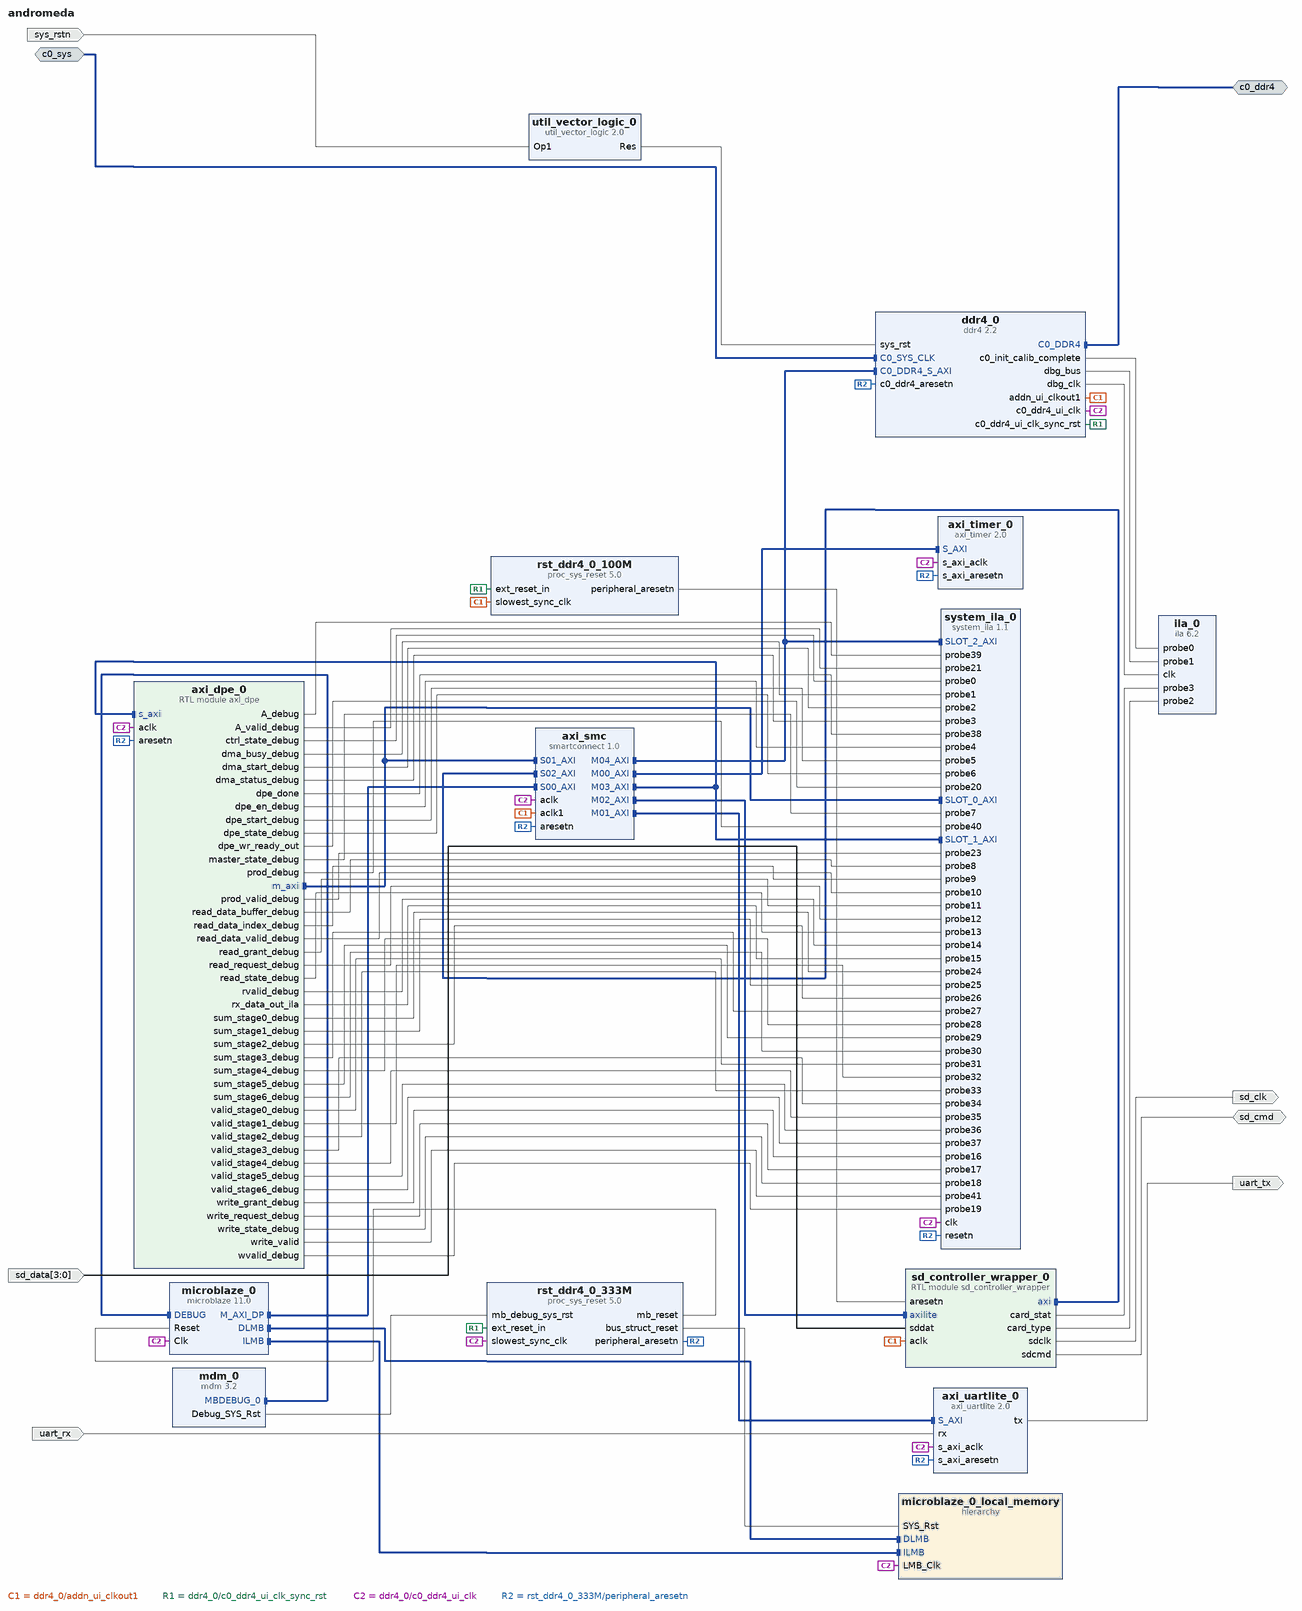
[diagram p0: block diagram of the top level]
# Vivado block design andromeda, xcku5p-ffvb676-2-i, Vivado 2024.2
create_bd_design andromeda

create_bd_intf_port -mode Master -vlnv xilinx.com:interface:ddr4_rtl:1.0 c0_ddr4
create_bd_intf_port -mode Slave -vlnv xilinx.com:interface:diff_clock_rtl:1.0 c0_sys
set_property -dict {CONFIG.FREQ_HZ 200000000} [get_bd_intf_ports c0_sys]
create_bd_port -dir I -type rst sys_rstn
set_property -dict {CONFIG.POLARITY ACTIVE_LOW} [get_bd_ports sys_rstn]
create_bd_port -dir O sd_clk
create_bd_port -dir IO sd_cmd
create_bd_port -dir I -from 3 -to 0 sd_data
create_bd_port -dir I uart_rx
create_bd_port -dir O uart_tx

create_bd_cell -type ip -vlnv xilinx.com:ip:ddr4:2.2 ddr4_0
set_property -dict [list \
  CONFIG.ADDN_UI_CLKOUT1_FREQ_HZ 100 \
  CONFIG.C0.DDR4_AxiIDWidth 4 \
  CONFIG.C0.DDR4_CasLatency 19 \
  CONFIG.C0.DDR4_DataWidth 32 \
  CONFIG.C0.DDR4_InputClockPeriod 5000 \
  CONFIG.C0.DDR4_MemoryPart MT40A512M16LY-075 \
  CONFIG.C0.MIGRATION false \
] [get_bd_cells ddr4_0]
create_bd_cell -type ip -vlnv xilinx.com:ip:ila:6.2 ila_0
set_property -dict [list \
  CONFIG.C_MONITOR_TYPE Native \
  CONFIG.C_NUM_OF_PROBES 4 \
  CONFIG.C_PROBE1_WIDTH 512 \
  CONFIG.C_PROBE2_WIDTH 2 \
  CONFIG.C_PROBE3_WIDTH 4 \
] [get_bd_cells ila_0]
create_bd_cell -type ip -vlnv xilinx.com:ip:util_vector_logic:2.0 util_vector_logic_0
set_property -dict {CONFIG.C_OPERATION not CONFIG.C_SIZE 1} [get_bd_cells util_vector_logic_0]
create_bd_cell -type ip -vlnv xilinx.com:ip:microblaze:11.0 microblaze_0
set_property -dict [list \
  CONFIG.C_DEBUG_ENABLED 1 \
  CONFIG.C_D_AXI 1 \
  CONFIG.C_D_LMB 1 \
  CONFIG.C_ENABLE_CONVERSION 0 \
  CONFIG.C_I_LMB 1 \
  CONFIG.C_USE_DCACHE 0 \
  CONFIG.C_USE_ICACHE 0 \
] [get_bd_cells microblaze_0]
create_bd_cell -type ip -vlnv xilinx.com:ip:axi_uartlite:2.0 axi_uartlite_0
create_bd_cell -type module -reference sd_controller_wrapper sd_controller_wrapper_0
create_bd_cell -type ip -vlnv xilinx.com:ip:axi_timer:2.0 axi_timer_0
create_bd_cell -type hier microblaze_0_local_memory
create_bd_cell -type ip -vlnv xilinx.com:ip:proc_sys_reset:5.0 rst_ddr4_0_333M
create_bd_cell -type ip -vlnv xilinx.com:ip:proc_sys_reset:5.0 rst_ddr4_0_100M
create_bd_cell -type ip -vlnv xilinx.com:ip:smartconnect:1.0 axi_smc
set_property -dict {CONFIG.NUM_CLKS 2 CONFIG.NUM_MI 5 CONFIG.NUM_SI 3} [get_bd_cells axi_smc]
create_bd_cell -type module -reference axi_dpe axi_dpe_0
create_bd_cell -type ip -vlnv xilinx.com:ip:mdm:3.2 mdm_0
create_bd_cell -type ip -vlnv xilinx.com:ip:system_ila:1.1 system_ila_0
set_property -dict [list \
  CONFIG.C_MON_TYPE MIX \
  CONFIG.C_NUM_MONITOR_SLOTS 3 \
  CONFIG.C_NUM_OF_PROBES 42 \
  CONFIG.C_PROBE0_TYPE 0 \
  CONFIG.C_PROBE10_TYPE 0 \
  CONFIG.C_PROBE11_TYPE 0 \
  CONFIG.C_PROBE12_TYPE 0 \
  CONFIG.C_PROBE13_TYPE 0 \
  CONFIG.C_PROBE14_TYPE 0 \
  CONFIG.C_PROBE15_TYPE 0 \
  CONFIG.C_PROBE16_TYPE 0 \
  CONFIG.C_PROBE17_TYPE 0 \
  CONFIG.C_PROBE18_TYPE 0 \
  CONFIG.C_PROBE19_TYPE 0 \
  CONFIG.C_PROBE1_TYPE 0 \
  CONFIG.C_PROBE20_TYPE 0 \
  CONFIG.C_PROBE21_TYPE 0 \
  CONFIG.C_PROBE22_TYPE 0 \
  CONFIG.C_PROBE23_TYPE 0 \
  CONFIG.C_PROBE24_TYPE 0 \
  CONFIG.C_PROBE25_TYPE 0 \
  CONFIG.C_PROBE26_TYPE 0 \
  CONFIG.C_PROBE27_TYPE 0 \
  CONFIG.C_PROBE28_TYPE 0 \
  CONFIG.C_PROBE29_TYPE 0 \
  CONFIG.C_PROBE2_TYPE 0 \
  CONFIG.C_PROBE30_TYPE 0 \
  CONFIG.C_PROBE31_TYPE 0 \
  CONFIG.C_PROBE32_TYPE 0 \
  CONFIG.C_PROBE33_TYPE 0 \
  CONFIG.C_PROBE34_TYPE 0 \
  CONFIG.C_PROBE35_TYPE 0 \
  CONFIG.C_PROBE36_TYPE 0 \
  CONFIG.C_PROBE37_TYPE 0 \
  CONFIG.C_PROBE38_TYPE 0 \
  CONFIG.C_PROBE39_TYPE 0 \
  CONFIG.C_PROBE3_TYPE 0 \
  CONFIG.C_PROBE40_TYPE 0 \
  CONFIG.C_PROBE41_TYPE 0 \
  CONFIG.C_PROBE4_TYPE 0 \
  CONFIG.C_PROBE5_TYPE 0 \
  CONFIG.C_PROBE6_TYPE 0 \
  CONFIG.C_PROBE7_TYPE 0 \
  CONFIG.C_PROBE8_TYPE 0 \
  CONFIG.C_PROBE9_TYPE 0 \
  CONFIG.C_SLOT_0_APC_EN 0 \
  CONFIG.C_SLOT_0_AXI_AR_SEL_DATA 1 \
  CONFIG.C_SLOT_0_AXI_AR_SEL_TRIG 1 \
  CONFIG.C_SLOT_0_AXI_AW_SEL_DATA 1 \
  CONFIG.C_SLOT_0_AXI_AW_SEL_TRIG 1 \
  CONFIG.C_SLOT_0_AXI_B_SEL_DATA 1 \
  CONFIG.C_SLOT_0_AXI_B_SEL_TRIG 1 \
  CONFIG.C_SLOT_0_AXI_R_SEL_DATA 1 \
  CONFIG.C_SLOT_0_AXI_R_SEL_TRIG 1 \
  CONFIG.C_SLOT_0_AXI_W_SEL_DATA 1 \
  CONFIG.C_SLOT_0_AXI_W_SEL_TRIG 1 \
  CONFIG.C_SLOT_0_INTF_TYPE xilinx.com:interface:aximm_rtl:1.0 \
  CONFIG.C_SLOT_1_APC_EN 0 \
  CONFIG.C_SLOT_1_AXI_AR_SEL_DATA 1 \
  CONFIG.C_SLOT_1_AXI_AR_SEL_TRIG 1 \
  CONFIG.C_SLOT_1_AXI_AW_SEL_DATA 1 \
  CONFIG.C_SLOT_1_AXI_AW_SEL_TRIG 1 \
  CONFIG.C_SLOT_1_AXI_B_SEL_DATA 1 \
  CONFIG.C_SLOT_1_AXI_B_SEL_TRIG 1 \
  CONFIG.C_SLOT_1_AXI_R_SEL_DATA 1 \
  CONFIG.C_SLOT_1_AXI_R_SEL_TRIG 1 \
  CONFIG.C_SLOT_1_AXI_W_SEL_DATA 1 \
  CONFIG.C_SLOT_1_AXI_W_SEL_TRIG 1 \
  CONFIG.C_SLOT_1_INTF_TYPE xilinx.com:interface:aximm_rtl:1.0 \
  CONFIG.C_SLOT_2_APC_EN 0 \
  CONFIG.C_SLOT_2_AXI_AR_SEL_DATA 1 \
  CONFIG.C_SLOT_2_AXI_AR_SEL_TRIG 1 \
  CONFIG.C_SLOT_2_AXI_AW_SEL_DATA 1 \
  CONFIG.C_SLOT_2_AXI_AW_SEL_TRIG 1 \
  CONFIG.C_SLOT_2_AXI_B_SEL_DATA 1 \
  CONFIG.C_SLOT_2_AXI_B_SEL_TRIG 1 \
  CONFIG.C_SLOT_2_AXI_R_SEL_DATA 1 \
  CONFIG.C_SLOT_2_AXI_R_SEL_TRIG 1 \
  CONFIG.C_SLOT_2_AXI_W_SEL_DATA 1 \
  CONFIG.C_SLOT_2_AXI_W_SEL_TRIG 1 \
  CONFIG.C_SLOT_2_INTF_TYPE xilinx.com:interface:aximm_rtl:1.0 \
] [get_bd_cells system_ila_0]

# ---- hierarchy /microblaze_0_local_memory ----
current_bd_instance /microblaze_0_local_memory
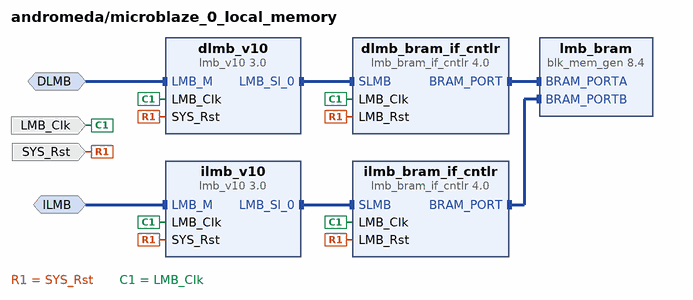
[diagram p1: block diagram inside /microblaze_0_local_memory]
create_bd_intf_pin -mode MirroredMaster -vlnv xilinx.com:interface:lmb_rtl:1.0 DLMB
create_bd_intf_pin -mode MirroredMaster -vlnv xilinx.com:interface:lmb_rtl:1.0 ILMB
create_bd_pin -dir I -type clk LMB_Clk
create_bd_pin -dir I -type rst SYS_Rst

create_bd_cell -type ip -vlnv xilinx.com:ip:lmb_v10:3.0 dlmb_v10
create_bd_cell -type ip -vlnv xilinx.com:ip:lmb_v10:3.0 ilmb_v10
create_bd_cell -type ip -vlnv xilinx.com:ip:lmb_bram_if_cntlr:4.0 dlmb_bram_if_cntlr
set_property -dict {CONFIG.C_ECC 0} [get_bd_cells dlmb_bram_if_cntlr]
create_bd_cell -type ip -vlnv xilinx.com:ip:lmb_bram_if_cntlr:4.0 ilmb_bram_if_cntlr
set_property -dict {CONFIG.C_ECC 0} [get_bd_cells ilmb_bram_if_cntlr]
create_bd_cell -type ip -vlnv xilinx.com:ip:blk_mem_gen:8.4 lmb_bram
set_property -dict {CONFIG.Memory_Type True_Dual_Port_RAM CONFIG.use_bram_block BRAM_Controller} [get_bd_cells lmb_bram]

# ---- connections ----

current_bd_instance /microblaze_0_local_memory
connect_bd_intf_net -intf_net microblaze_0_dlmb [get_bd_intf_pins dlmb_v10/LMB_M] [get_bd_intf_pins DLMB]
connect_bd_intf_net -intf_net microblaze_0_dlmb_bus [get_bd_intf_pins dlmb_v10/LMB_Sl_0] [get_bd_intf_pins dlmb_bram_if_cntlr/SLMB]
connect_bd_intf_net -intf_net microblaze_0_dlmb_cntlr [get_bd_intf_pins dlmb_bram_if_cntlr/BRAM_PORT] [get_bd_intf_pins lmb_bram/BRAM_PORTA]
connect_bd_intf_net -intf_net microblaze_0_ilmb [get_bd_intf_pins ilmb_v10/LMB_M] [get_bd_intf_pins ILMB]
connect_bd_intf_net -intf_net microblaze_0_ilmb_bus [get_bd_intf_pins ilmb_v10/LMB_Sl_0] [get_bd_intf_pins ilmb_bram_if_cntlr/SLMB]
connect_bd_intf_net -intf_net microblaze_0_ilmb_cntlr [get_bd_intf_pins ilmb_bram_if_cntlr/BRAM_PORT] [get_bd_intf_pins lmb_bram/BRAM_PORTB]
connect_bd_net [get_bd_pins SYS_Rst] \
  [get_bd_pins dlmb_v10/SYS_Rst] [get_bd_pins dlmb_bram_if_cntlr/LMB_Rst] [get_bd_pins ilmb_v10/SYS_Rst] \
  [get_bd_pins ilmb_bram_if_cntlr/LMB_Rst]
connect_bd_net -net microblaze_0_Clk [get_bd_pins LMB_Clk] \
  [get_bd_pins dlmb_v10/LMB_Clk] [get_bd_pins dlmb_bram_if_cntlr/LMB_Clk] [get_bd_pins ilmb_v10/LMB_Clk] \
  [get_bd_pins ilmb_bram_if_cntlr/LMB_Clk]
set_property HDL_ATTRIBUTE.BMM_INFO_ADDRESS_SPACE {byte  0x00000000 32 > andromeda microblaze_0_local_memory/lmb_bram} [get_bd_cells dlmb_bram_if_cntlr]
set_property HDL_ATTRIBUTE.KEEP_HIERARCHY yes [get_bd_cells dlmb_bram_if_cntlr]

current_bd_instance /
connect_bd_intf_net -intf_net axi_dpe_0_m_axi [get_bd_intf_pins axi_dpe_0/m_axi] [get_bd_intf_pins axi_smc/S01_AXI]
connect_bd_intf_net [get_bd_intf_pins axi_dpe_0/m_axi] [get_bd_intf_pins system_ila_0/SLOT_0_AXI]
connect_bd_intf_net [get_bd_intf_pins axi_smc/M00_AXI] [get_bd_intf_pins axi_timer_0/S_AXI]
connect_bd_intf_net [get_bd_intf_pins axi_smc/M01_AXI] [get_bd_intf_pins axi_uartlite_0/S_AXI]
connect_bd_intf_net [get_bd_intf_pins axi_smc/M02_AXI] [get_bd_intf_pins sd_controller_wrapper_0/axilite]
connect_bd_intf_net -intf_net axi_smc_M03_AXI [get_bd_intf_pins axi_smc/M03_AXI] [get_bd_intf_pins axi_dpe_0/s_axi]
connect_bd_intf_net [get_bd_intf_pins axi_smc/M03_AXI] [get_bd_intf_pins system_ila_0/SLOT_1_AXI]
connect_bd_intf_net -intf_net axi_smc_M04_AXI [get_bd_intf_pins axi_smc/M04_AXI] [get_bd_intf_pins ddr4_0/C0_DDR4_S_AXI]
connect_bd_intf_net [get_bd_intf_pins axi_smc/M04_AXI] [get_bd_intf_pins system_ila_0/SLOT_2_AXI]
connect_bd_intf_net [get_bd_intf_ports c0_ddr4] [get_bd_intf_pins ddr4_0/C0_DDR4]
connect_bd_intf_net -intf_net diff_clock_rtl_0_1 [get_bd_intf_ports c0_sys] [get_bd_intf_pins ddr4_0/C0_SYS_CLK]
connect_bd_intf_net [get_bd_intf_pins mdm_0/MBDEBUG_0] [get_bd_intf_pins microblaze_0/DEBUG]
connect_bd_intf_net [get_bd_intf_pins microblaze_0/M_AXI_DP] [get_bd_intf_pins axi_smc/S00_AXI]
connect_bd_intf_net [get_bd_intf_pins microblaze_0/DLMB] [get_bd_intf_pins microblaze_0_local_memory/DLMB]
connect_bd_intf_net [get_bd_intf_pins microblaze_0/ILMB] [get_bd_intf_pins microblaze_0_local_memory/ILMB]
connect_bd_intf_net [get_bd_intf_pins sd_controller_wrapper_0/axi] [get_bd_intf_pins axi_smc/S02_AXI]
connect_bd_net -net A_debug [get_bd_pins axi_dpe_0/A_debug] [get_bd_pins system_ila_0/probe39]
connect_bd_net -net A_valid_debug [get_bd_pins axi_dpe_0/A_valid_debug] [get_bd_pins system_ila_0/probe21]
connect_bd_net [get_bd_ports sd_cmd] [get_bd_pins sd_controller_wrapper_0/sdcmd]
connect_bd_net [get_bd_pins axi_uartlite_0/tx] [get_bd_ports uart_tx]
connect_bd_net -net ctrl_state_debug [get_bd_pins axi_dpe_0/ctrl_state_debug] [get_bd_pins system_ila_0/probe0]
connect_bd_net [get_bd_pins ddr4_0/addn_ui_clkout1] \
  [get_bd_pins sd_controller_wrapper_0/aclk] [get_bd_pins rst_ddr4_0_100M/slowest_sync_clk] [get_bd_pins axi_smc/aclk1]
connect_bd_net [get_bd_pins ddr4_0/c0_ddr4_ui_clk_sync_rst] [get_bd_pins rst_ddr4_0_333M/ext_reset_in] [get_bd_pins rst_ddr4_0_100M/ext_reset_in]
connect_bd_net [get_bd_pins ddr4_0/c0_init_calib_complete] [get_bd_pins ila_0/probe0]
connect_bd_net [get_bd_pins ddr4_0/dbg_bus] [get_bd_pins ila_0/probe1]
connect_bd_net [get_bd_pins ddr4_0/dbg_clk] [get_bd_pins ila_0/clk]
connect_bd_net -net dma_busy_debug [get_bd_pins axi_dpe_0/dma_busy_debug] [get_bd_pins system_ila_0/probe1]
connect_bd_net -net dma_start_debug [get_bd_pins axi_dpe_0/dma_start_debug] [get_bd_pins system_ila_0/probe2]
connect_bd_net -net dma_status_debug [get_bd_pins axi_dpe_0/dma_status_debug] [get_bd_pins system_ila_0/probe3]
connect_bd_net -net dpe_done [get_bd_pins axi_dpe_0/dpe_done] [get_bd_pins system_ila_0/probe38]
connect_bd_net -net dpe_en_debug [get_bd_pins axi_dpe_0/dpe_en_debug] [get_bd_pins system_ila_0/probe4]
connect_bd_net -net dpe_start_debug [get_bd_pins axi_dpe_0/dpe_start_debug] [get_bd_pins system_ila_0/probe5]
connect_bd_net -net dpe_state_debug [get_bd_pins axi_dpe_0/dpe_state_debug] [get_bd_pins system_ila_0/probe6]
connect_bd_net -net dpe_wr_ready_out [get_bd_pins axi_dpe_0/dpe_wr_ready_out] [get_bd_pins system_ila_0/probe20]
connect_bd_net -net master_state_debug [get_bd_pins axi_dpe_0/master_state_debug] [get_bd_pins system_ila_0/probe7]
connect_bd_net [get_bd_pins mdm_0/Debug_SYS_Rst] [get_bd_pins rst_ddr4_0_333M/mb_debug_sys_rst]
connect_bd_net -net microblaze_0_Clk [get_bd_pins ddr4_0/c0_ddr4_ui_clk] \
  [get_bd_pins microblaze_0/Clk] [get_bd_pins microblaze_0_local_memory/LMB_Clk] \
  [get_bd_pins rst_ddr4_0_333M/slowest_sync_clk] [get_bd_pins axi_timer_0/s_axi_aclk] [get_bd_pins axi_uartlite_0/s_axi_aclk] \
  [get_bd_pins axi_smc/aclk] [get_bd_pins system_ila_0/clk] [get_bd_pins axi_dpe_0/aclk]
connect_bd_net -net prod_debug [get_bd_pins axi_dpe_0/prod_debug] [get_bd_pins system_ila_0/probe40]
connect_bd_net -net prod_valid_debug [get_bd_pins axi_dpe_0/prod_valid_debug] [get_bd_pins system_ila_0/probe23]
connect_bd_net -net read_data_buffer_debug [get_bd_pins axi_dpe_0/read_data_buffer_debug] [get_bd_pins system_ila_0/probe8]
connect_bd_net -net read_data_index_debug [get_bd_pins axi_dpe_0/read_data_index_debug] [get_bd_pins system_ila_0/probe9]
connect_bd_net -net read_data_valid_debug [get_bd_pins axi_dpe_0/read_data_valid_debug] [get_bd_pins system_ila_0/probe10]
connect_bd_net -net read_grant_debug [get_bd_pins axi_dpe_0/read_grant_debug] [get_bd_pins system_ila_0/probe11]
connect_bd_net -net read_request_debug [get_bd_pins axi_dpe_0/read_request_debug] [get_bd_pins system_ila_0/probe12]
connect_bd_net -net read_state_debug [get_bd_pins axi_dpe_0/read_state_debug] [get_bd_pins system_ila_0/probe13]
connect_bd_net [get_bd_pins rst_ddr4_0_100M/peripheral_aresetn] [get_bd_pins sd_controller_wrapper_0/aresetn]
connect_bd_net [get_bd_pins rst_ddr4_0_333M/bus_struct_reset] [get_bd_pins microblaze_0_local_memory/SYS_Rst]
connect_bd_net [get_bd_pins rst_ddr4_0_333M/mb_reset] [get_bd_pins microblaze_0/Reset]
connect_bd_net [get_bd_pins rst_ddr4_0_333M/peripheral_aresetn] \
  [get_bd_pins axi_timer_0/s_axi_aresetn] [get_bd_pins axi_uartlite_0/s_axi_aresetn] [get_bd_pins ddr4_0/c0_ddr4_aresetn] \
  [get_bd_pins axi_smc/aresetn] [get_bd_pins system_ila_0/resetn] [get_bd_pins axi_dpe_0/aresetn]
connect_bd_net -net rvalid_debug [get_bd_pins axi_dpe_0/rvalid_debug] [get_bd_pins system_ila_0/probe14]
connect_bd_net -net rx_data_out_ila [get_bd_pins axi_dpe_0/rx_data_out_ila] [get_bd_pins system_ila_0/probe15]
connect_bd_net [get_bd_pins sd_controller_wrapper_0/card_stat] [get_bd_pins ila_0/probe3]
connect_bd_net [get_bd_pins sd_controller_wrapper_0/card_type] [get_bd_pins ila_0/probe2]
connect_bd_net [get_bd_pins sd_controller_wrapper_0/sdclk] [get_bd_ports sd_clk]
connect_bd_net [get_bd_ports sd_data] [get_bd_pins sd_controller_wrapper_0/sddat]
connect_bd_net -net sum_stage0_debug [get_bd_pins axi_dpe_0/sum_stage0_debug] [get_bd_pins system_ila_0/probe24]
connect_bd_net -net sum_stage1_debug [get_bd_pins axi_dpe_0/sum_stage1_debug] [get_bd_pins system_ila_0/probe25]
connect_bd_net -net sum_stage2_debug [get_bd_pins axi_dpe_0/sum_stage2_debug] [get_bd_pins system_ila_0/probe26]
connect_bd_net -net sum_stage3_debug [get_bd_pins axi_dpe_0/sum_stage3_debug] [get_bd_pins system_ila_0/probe27]
connect_bd_net -net sum_stage4_debug [get_bd_pins axi_dpe_0/sum_stage4_debug] [get_bd_pins system_ila_0/probe28]
connect_bd_net -net sum_stage5_debug [get_bd_pins axi_dpe_0/sum_stage5_debug] [get_bd_pins system_ila_0/probe29]
connect_bd_net -net sum_stage6_debug [get_bd_pins axi_dpe_0/sum_stage6_debug] [get_bd_pins system_ila_0/probe30]
connect_bd_net [get_bd_ports sys_rstn] [get_bd_pins util_vector_logic_0/Op1]
connect_bd_net [get_bd_ports uart_rx] [get_bd_pins axi_uartlite_0/rx]
connect_bd_net [get_bd_pins util_vector_logic_0/Res] [get_bd_pins ddr4_0/sys_rst]
connect_bd_net -net valid_stage0_debug [get_bd_pins axi_dpe_0/valid_stage0_debug] [get_bd_pins system_ila_0/probe31]
connect_bd_net -net valid_stage1_debug [get_bd_pins axi_dpe_0/valid_stage1_debug] [get_bd_pins system_ila_0/probe32]
connect_bd_net -net valid_stage2_debug [get_bd_pins axi_dpe_0/valid_stage2_debug] [get_bd_pins system_ila_0/probe33]
connect_bd_net -net valid_stage3_debug [get_bd_pins axi_dpe_0/valid_stage3_debug] [get_bd_pins system_ila_0/probe34]
connect_bd_net -net valid_stage4_debug [get_bd_pins axi_dpe_0/valid_stage4_debug] [get_bd_pins system_ila_0/probe35]
connect_bd_net -net valid_stage5_debug [get_bd_pins axi_dpe_0/valid_stage5_debug] [get_bd_pins system_ila_0/probe36]
connect_bd_net -net valid_stage6_debug [get_bd_pins axi_dpe_0/valid_stage6_debug] [get_bd_pins system_ila_0/probe37]
connect_bd_net -net write_grant_debug [get_bd_pins axi_dpe_0/write_grant_debug] [get_bd_pins system_ila_0/probe16]
connect_bd_net -net write_request_debug [get_bd_pins axi_dpe_0/write_request_debug] [get_bd_pins system_ila_0/probe17]
connect_bd_net -net write_state_debug [get_bd_pins axi_dpe_0/write_state_debug] [get_bd_pins system_ila_0/probe18]
connect_bd_net -net write_valid [get_bd_pins axi_dpe_0/write_valid] [get_bd_pins system_ila_0/probe41]
connect_bd_net -net wvalid_debug [get_bd_pins axi_dpe_0/wvalid_debug] [get_bd_pins system_ila_0/probe19]
set_property PFM.AXI_PORT {C0_DDR4_S_AXI_CTRL {memport "MIG" sptag "" memory "" is_range "false"}} [get_bd_cells ddr4_0]
set_property HDL_ATTRIBUTE.BMM_INFO_PROCESSOR {microblaze-le > andromeda microblaze_0_local_memory/dlmb_bram_if_cntlr} [get_bd_cells microblaze_0]
set_property HDL_ATTRIBUTE.KEEP_HIERARCHY yes [get_bd_cells microblaze_0]
set_property HDL_ATTRIBUTE.DEBUG true [get_bd_intf_nets axi_dpe_0_m_axi]
set_property HDL_ATTRIBUTE.MARK_DEBUG true [get_bd_intf_nets axi_dpe_0_m_axi]
set_property HDL_ATTRIBUTE.DEBUG true [get_bd_intf_nets axi_smc_M03_AXI]
set_property HDL_ATTRIBUTE.MARK_DEBUG true [get_bd_intf_nets axi_smc_M03_AXI]
set_property HDL_ATTRIBUTE.DEBUG true [get_bd_intf_nets axi_smc_M04_AXI]
set_property HDL_ATTRIBUTE.MARK_DEBUG true [get_bd_intf_nets axi_smc_M04_AXI]
set_property HDL_ATTRIBUTE.DEBUG true [get_bd_nets A_debug]
set_property HDL_ATTRIBUTE.MARK_DEBUG true [get_bd_nets A_debug]
set_property HDL_ATTRIBUTE.DEBUG true [get_bd_nets A_valid_debug]
set_property HDL_ATTRIBUTE.MARK_DEBUG true [get_bd_nets A_valid_debug]
set_property HDL_ATTRIBUTE.DEBUG true [get_bd_nets ctrl_state_debug]
set_property HDL_ATTRIBUTE.MARK_DEBUG true [get_bd_nets ctrl_state_debug]
set_property HDL_ATTRIBUTE.DEBUG true [get_bd_nets dma_busy_debug]
set_property HDL_ATTRIBUTE.MARK_DEBUG true [get_bd_nets dma_busy_debug]
set_property HDL_ATTRIBUTE.DEBUG true [get_bd_nets dma_start_debug]
set_property HDL_ATTRIBUTE.MARK_DEBUG true [get_bd_nets dma_start_debug]
set_property HDL_ATTRIBUTE.DEBUG true [get_bd_nets dma_status_debug]
set_property HDL_ATTRIBUTE.MARK_DEBUG true [get_bd_nets dma_status_debug]
set_property HDL_ATTRIBUTE.DEBUG true [get_bd_nets dpe_done]
set_property HDL_ATTRIBUTE.MARK_DEBUG true [get_bd_nets dpe_done]
set_property HDL_ATTRIBUTE.DEBUG true [get_bd_nets dpe_en_debug]
set_property HDL_ATTRIBUTE.MARK_DEBUG true [get_bd_nets dpe_en_debug]
set_property HDL_ATTRIBUTE.DEBUG true [get_bd_nets dpe_start_debug]
set_property HDL_ATTRIBUTE.MARK_DEBUG true [get_bd_nets dpe_start_debug]
set_property HDL_ATTRIBUTE.DEBUG true [get_bd_nets dpe_state_debug]
set_property HDL_ATTRIBUTE.MARK_DEBUG true [get_bd_nets dpe_state_debug]
set_property HDL_ATTRIBUTE.DEBUG true [get_bd_nets dpe_wr_ready_out]
set_property HDL_ATTRIBUTE.MARK_DEBUG true [get_bd_nets dpe_wr_ready_out]
set_property HDL_ATTRIBUTE.DEBUG true [get_bd_nets master_state_debug]
set_property HDL_ATTRIBUTE.MARK_DEBUG true [get_bd_nets master_state_debug]
set_property HDL_ATTRIBUTE.DEBUG true [get_bd_nets prod_debug]
set_property HDL_ATTRIBUTE.MARK_DEBUG true [get_bd_nets prod_debug]
set_property HDL_ATTRIBUTE.DEBUG true [get_bd_nets prod_valid_debug]
set_property HDL_ATTRIBUTE.MARK_DEBUG true [get_bd_nets prod_valid_debug]
set_property HDL_ATTRIBUTE.DEBUG true [get_bd_nets read_data_buffer_debug]
set_property HDL_ATTRIBUTE.MARK_DEBUG true [get_bd_nets read_data_buffer_debug]
set_property HDL_ATTRIBUTE.DEBUG true [get_bd_nets read_data_index_debug]
set_property HDL_ATTRIBUTE.MARK_DEBUG true [get_bd_nets read_data_index_debug]
set_property HDL_ATTRIBUTE.DEBUG true [get_bd_nets read_data_valid_debug]
set_property HDL_ATTRIBUTE.MARK_DEBUG true [get_bd_nets read_data_valid_debug]
set_property HDL_ATTRIBUTE.DEBUG true [get_bd_nets read_grant_debug]
set_property HDL_ATTRIBUTE.MARK_DEBUG true [get_bd_nets read_grant_debug]
set_property HDL_ATTRIBUTE.DEBUG true [get_bd_nets read_request_debug]
set_property HDL_ATTRIBUTE.MARK_DEBUG true [get_bd_nets read_request_debug]
set_property HDL_ATTRIBUTE.DEBUG true [get_bd_nets read_state_debug]
set_property HDL_ATTRIBUTE.MARK_DEBUG true [get_bd_nets read_state_debug]
set_property HDL_ATTRIBUTE.DEBUG true [get_bd_nets rvalid_debug]
set_property HDL_ATTRIBUTE.MARK_DEBUG true [get_bd_nets rvalid_debug]
set_property HDL_ATTRIBUTE.DEBUG true [get_bd_nets rx_data_out_ila]
set_property HDL_ATTRIBUTE.MARK_DEBUG true [get_bd_nets rx_data_out_ila]
set_property HDL_ATTRIBUTE.DEBUG true [get_bd_nets sum_stage0_debug]
set_property HDL_ATTRIBUTE.MARK_DEBUG true [get_bd_nets sum_stage0_debug]
set_property HDL_ATTRIBUTE.DEBUG true [get_bd_nets sum_stage1_debug]
set_property HDL_ATTRIBUTE.MARK_DEBUG true [get_bd_nets sum_stage1_debug]
set_property HDL_ATTRIBUTE.DEBUG true [get_bd_nets sum_stage2_debug]
set_property HDL_ATTRIBUTE.MARK_DEBUG true [get_bd_nets sum_stage2_debug]
set_property HDL_ATTRIBUTE.DEBUG true [get_bd_nets sum_stage3_debug]
set_property HDL_ATTRIBUTE.MARK_DEBUG true [get_bd_nets sum_stage3_debug]
set_property HDL_ATTRIBUTE.DEBUG true [get_bd_nets sum_stage4_debug]
set_property HDL_ATTRIBUTE.MARK_DEBUG true [get_bd_nets sum_stage4_debug]
set_property HDL_ATTRIBUTE.DEBUG true [get_bd_nets sum_stage5_debug]
set_property HDL_ATTRIBUTE.MARK_DEBUG true [get_bd_nets sum_stage5_debug]
set_property HDL_ATTRIBUTE.DEBUG true [get_bd_nets sum_stage6_debug]
set_property HDL_ATTRIBUTE.MARK_DEBUG true [get_bd_nets sum_stage6_debug]
set_property HDL_ATTRIBUTE.DEBUG true [get_bd_nets valid_stage0_debug]
set_property HDL_ATTRIBUTE.MARK_DEBUG true [get_bd_nets valid_stage0_debug]
set_property HDL_ATTRIBUTE.DEBUG true [get_bd_nets valid_stage1_debug]
set_property HDL_ATTRIBUTE.MARK_DEBUG true [get_bd_nets valid_stage1_debug]
set_property HDL_ATTRIBUTE.DEBUG true [get_bd_nets valid_stage2_debug]
set_property HDL_ATTRIBUTE.MARK_DEBUG true [get_bd_nets valid_stage2_debug]
set_property HDL_ATTRIBUTE.DEBUG true [get_bd_nets valid_stage3_debug]
set_property HDL_ATTRIBUTE.MARK_DEBUG true [get_bd_nets valid_stage3_debug]
set_property HDL_ATTRIBUTE.DEBUG true [get_bd_nets valid_stage4_debug]
set_property HDL_ATTRIBUTE.MARK_DEBUG true [get_bd_nets valid_stage4_debug]
set_property HDL_ATTRIBUTE.DEBUG true [get_bd_nets valid_stage5_debug]
set_property HDL_ATTRIBUTE.MARK_DEBUG true [get_bd_nets valid_stage5_debug]
set_property HDL_ATTRIBUTE.DEBUG true [get_bd_nets valid_stage6_debug]
set_property HDL_ATTRIBUTE.MARK_DEBUG true [get_bd_nets valid_stage6_debug]
set_property HDL_ATTRIBUTE.DEBUG true [get_bd_nets write_grant_debug]
set_property HDL_ATTRIBUTE.MARK_DEBUG true [get_bd_nets write_grant_debug]
set_property HDL_ATTRIBUTE.DEBUG true [get_bd_nets write_request_debug]
set_property HDL_ATTRIBUTE.MARK_DEBUG true [get_bd_nets write_request_debug]
set_property HDL_ATTRIBUTE.DEBUG true [get_bd_nets write_state_debug]
set_property HDL_ATTRIBUTE.MARK_DEBUG true [get_bd_nets write_state_debug]
set_property HDL_ATTRIBUTE.DEBUG true [get_bd_nets write_valid]
set_property HDL_ATTRIBUTE.MARK_DEBUG true [get_bd_nets write_valid]
set_property HDL_ATTRIBUTE.DEBUG true [get_bd_nets wvalid_debug]
set_property HDL_ATTRIBUTE.MARK_DEBUG true [get_bd_nets wvalid_debug]

# ---- address map ----
assign_bd_address -offset 0x80000000 -range 2G -target_address_space [get_bd_addr_spaces axi_dpe_0/m_axi] [get_bd_addr_segs ddr4_0/C0_DDR4_MEMORY_MAP/C0_DDR4_ADDRESS_BLOCK]
exclude_bd_addr_seg -offset 0x00020000 -range 4K -target_address_space [get_bd_addr_spaces axi_dpe_0/m_axi] [get_bd_addr_segs sd_controller_wrapper_0/axilite/reg0]
exclude_bd_addr_seg -offset 0x00030000 -range 64K -target_address_space [get_bd_addr_spaces axi_dpe_0/m_axi] [get_bd_addr_segs axi_dpe_0/s_axi/reg0]
exclude_bd_addr_seg -offset 0x40600000 -range 64K -target_address_space [get_bd_addr_spaces axi_dpe_0/m_axi] [get_bd_addr_segs axi_uartlite_0/S_AXI/Reg]
exclude_bd_addr_seg -offset 0x41C00000 -range 64K -target_address_space [get_bd_addr_spaces axi_dpe_0/m_axi] [get_bd_addr_segs axi_timer_0/S_AXI/Reg]
assign_bd_address -offset 0x00000000 -range 128K -target_address_space [get_bd_addr_spaces microblaze_0/Data] [get_bd_addr_segs microblaze_0_local_memory/dlmb_bram_if_cntlr/SLMB/Mem]
assign_bd_address -offset 0x00020000 -range 4K -target_address_space [get_bd_addr_spaces microblaze_0/Data] [get_bd_addr_segs sd_controller_wrapper_0/axilite/reg0]
assign_bd_address -offset 0x00030000 -range 64K -target_address_space [get_bd_addr_spaces microblaze_0/Data] [get_bd_addr_segs axi_dpe_0/s_axi/reg0]
assign_bd_address -offset 0x40600000 -range 64K -target_address_space [get_bd_addr_spaces microblaze_0/Data] [get_bd_addr_segs axi_uartlite_0/S_AXI/Reg]
assign_bd_address -offset 0x41C00000 -range 64K -target_address_space [get_bd_addr_spaces microblaze_0/Data] [get_bd_addr_segs axi_timer_0/S_AXI/Reg]
assign_bd_address -offset 0x80000000 -range 2G -target_address_space [get_bd_addr_spaces microblaze_0/Data] [get_bd_addr_segs ddr4_0/C0_DDR4_MEMORY_MAP/C0_DDR4_ADDRESS_BLOCK]
assign_bd_address -offset 0x00000000 -range 128K -target_address_space [get_bd_addr_spaces microblaze_0/Instruction] [get_bd_addr_segs microblaze_0_local_memory/ilmb_bram_if_cntlr/SLMB/Mem]
assign_bd_address -offset 0x80000000 -range 2G -target_address_space [get_bd_addr_spaces sd_controller_wrapper_0/axi] [get_bd_addr_segs ddr4_0/C0_DDR4_MEMORY_MAP/C0_DDR4_ADDRESS_BLOCK]
exclude_bd_addr_seg -offset 0x00020000 -range 4K -target_address_space [get_bd_addr_spaces sd_controller_wrapper_0/axi] [get_bd_addr_segs sd_controller_wrapper_0/axilite/reg0]
exclude_bd_addr_seg -offset 0x00030000 -range 4K -target_address_space [get_bd_addr_spaces sd_controller_wrapper_0/axi] [get_bd_addr_segs axi_dpe_0/s_axi/reg0]
exclude_bd_addr_seg -offset 0x40600000 -range 64K -target_address_space [get_bd_addr_spaces sd_controller_wrapper_0/axi] [get_bd_addr_segs axi_uartlite_0/S_AXI/Reg]
exclude_bd_addr_seg -offset 0x41C00000 -range 64K -target_address_space [get_bd_addr_spaces sd_controller_wrapper_0/axi] [get_bd_addr_segs axi_timer_0/S_AXI/Reg]

validate_bd_design
save_bd_design
